# EasyEDA schematic SCH_Cansat_PCB_Flight_Computer_Only_2026-05-29.json
TITLE: CanSat Schematic; REV: 1.0; Date: 2026-03-24; Sheet: 1/1; Drawn By: Iker Garcia; Company: John Brown University
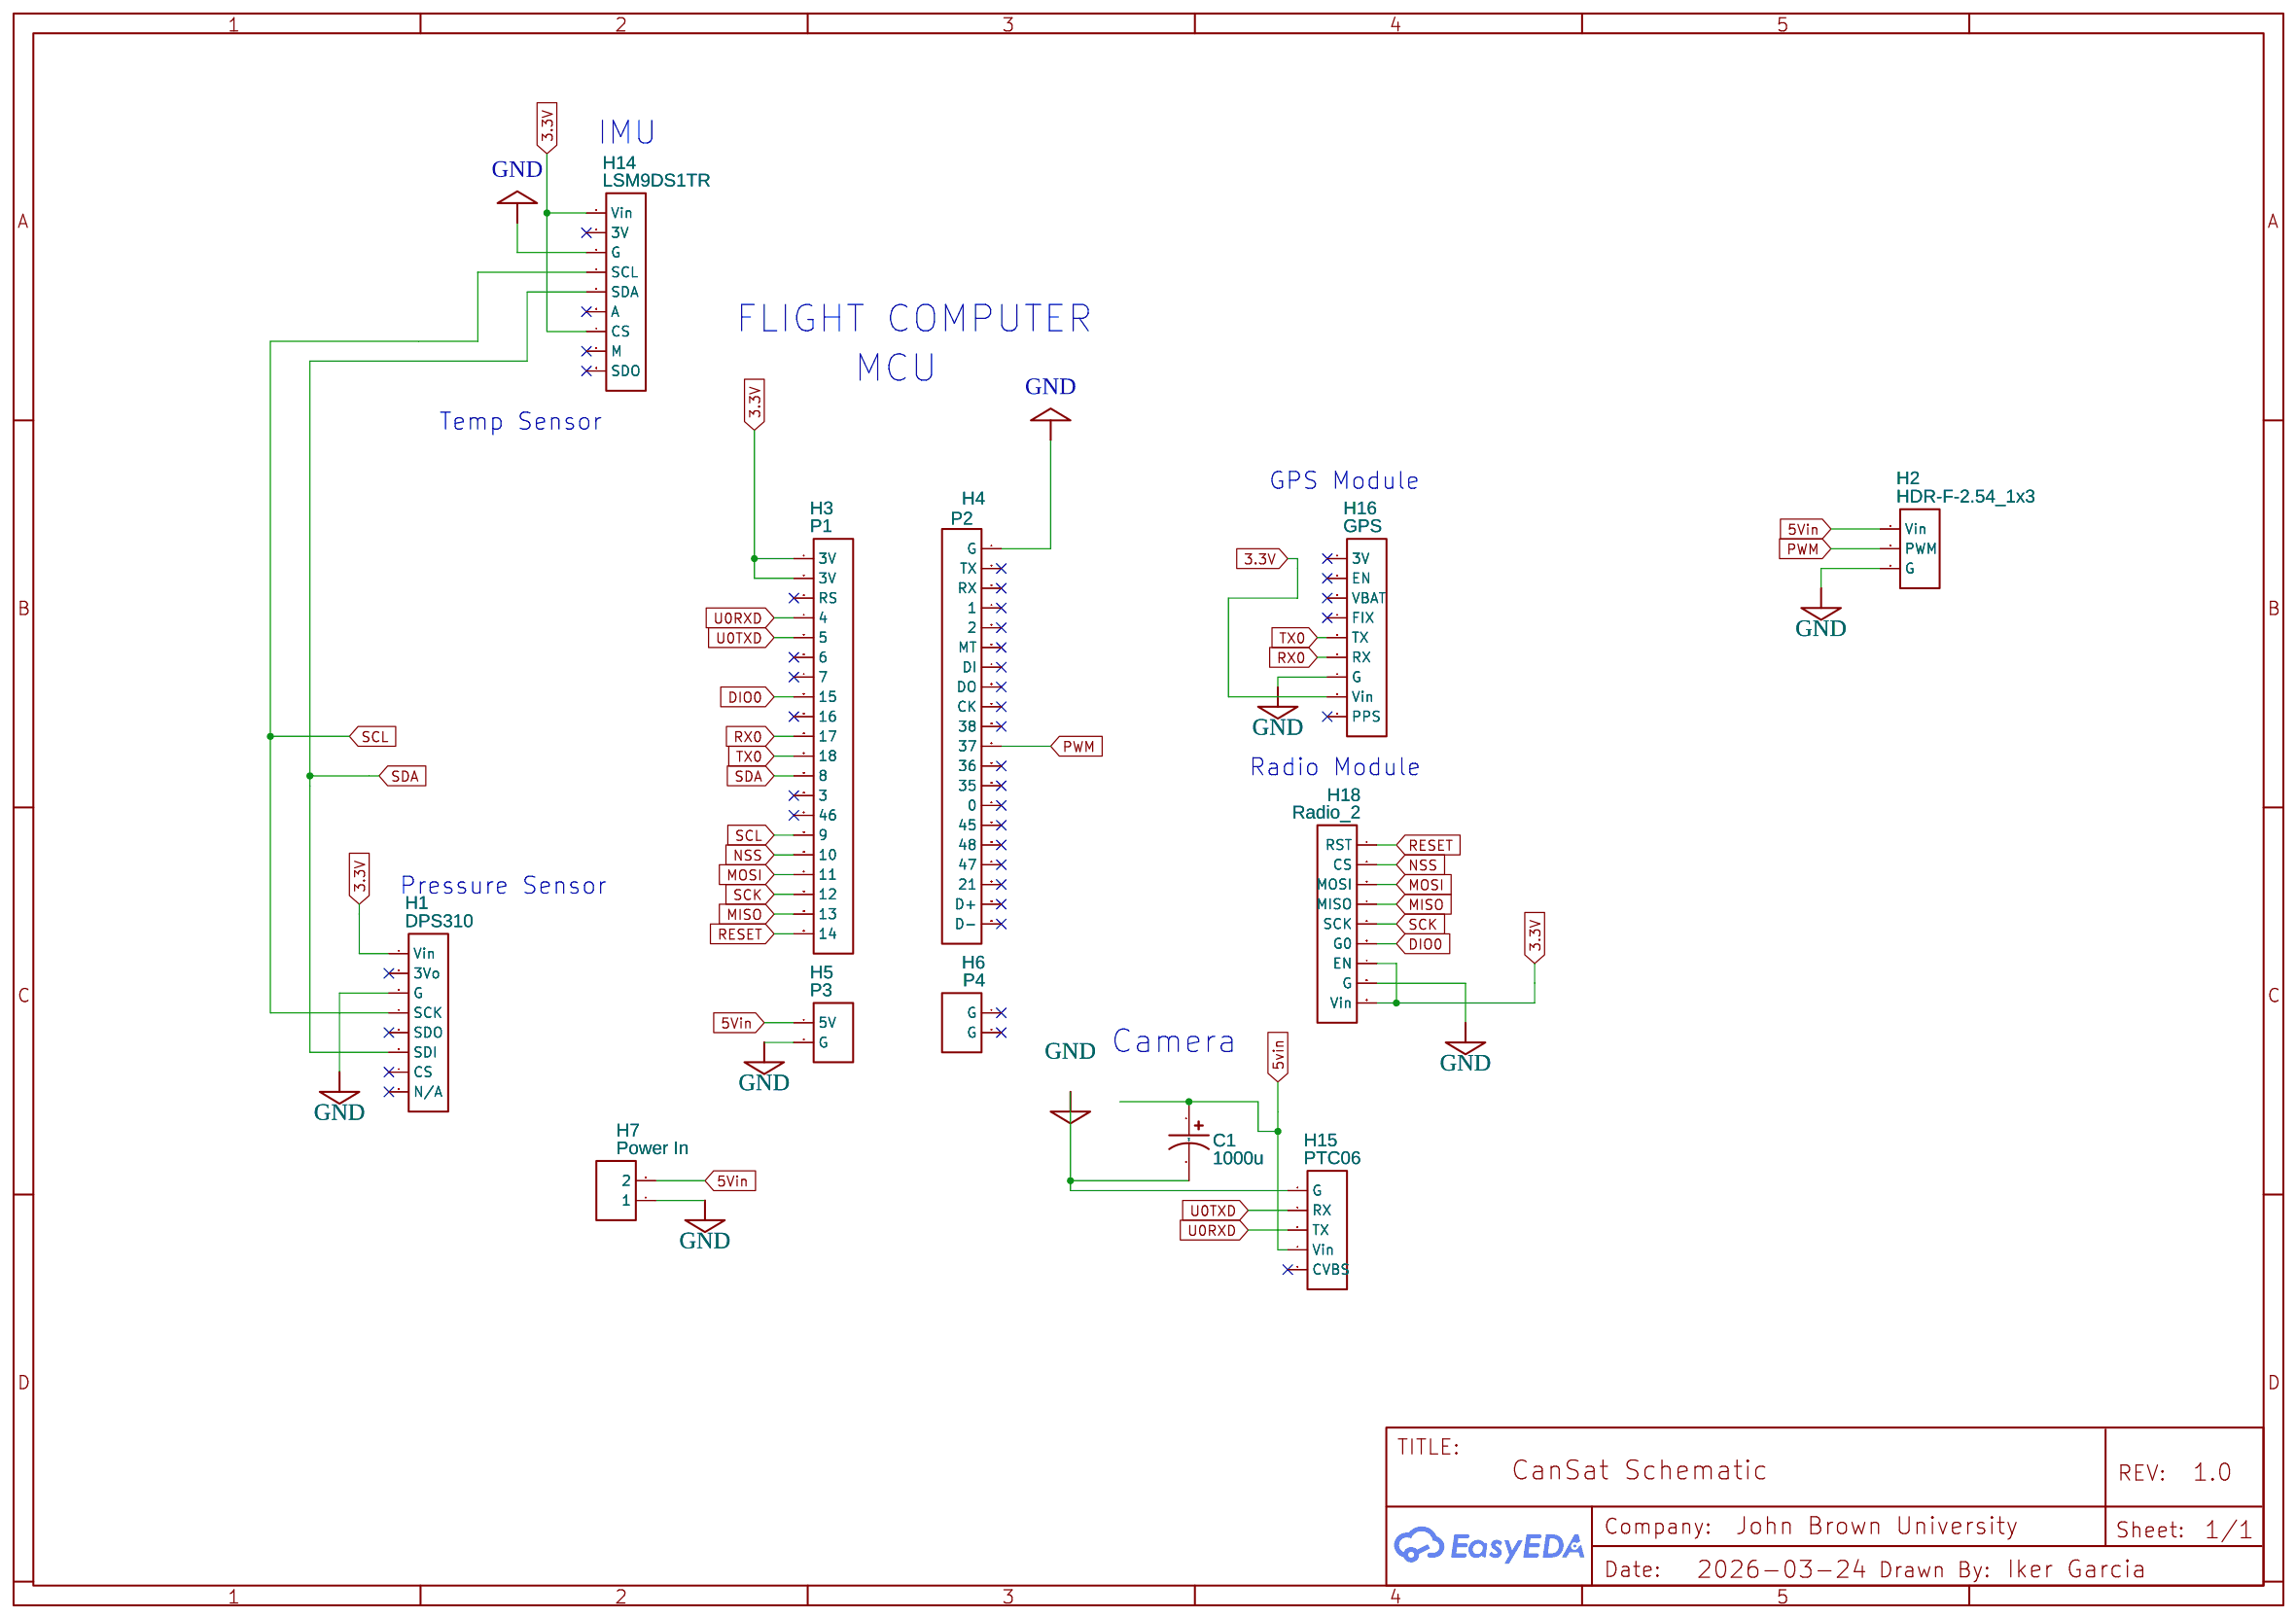
[diagram p0: schematic sheet]

## Parts
C1  1000u  [CAP-D6.3×F2.5]
H1  DPS310  [HDR-F-2.54_1X8]
H2  HDR-F-2.54_1x3  [HDR-F-2.54_1X3]
H3  P1  [HDR-F-2.54_1X20]
H4  P2  [HDR-F-2.54_1X20]
H5  P3  [HDR-F-2.54_1X2]
H6  P4  [HDR-F-2.54_1X2]
H7  Power In  [HDR-F-2.54_1X2]
H14  LSM9DS1TR  [HDR-F-2.54_1X9]
H15  PTC06  [HDR-F-2.54_1X5]
H16  GPS  [HDR-F-2.54_1X9]
H18  Radio_2  [HDR-F-2.54_1X9]

## Library data of the parts
C1 = CE_TH_D6.3×F2.5_US: Contributor: LCEDA_Lib
H1 = HDR-F-2.54_1x8: Supplier Part: C225505; Supplier: LCSC; Contributor: LCEDA_Lib
H2 = HDR-F-2.54_1x3: Supplier Part: C146690; Supplier: LCSC; Contributor: LCEDA_Lib
H3 H4 = HDR-F-2.54_1x20: Supplier Part: C50984; Supplier: LCSC; Contributor: LCEDA_Lib
H5-H7 = HDR-F-2.54_1x2: Supplier Part: C49661; Supplier: LCSC; Contributor: LCEDA_Lib
H14 H16 H18 = HDR-F-2.54_1x9: Supplier Part: C124417; Supplier: LCSC; Contributor: LCEDA_Lib
H15 = HDR-F-2.54_1x5: Supplier Part: C50950; Supplier: LCSC; Contributor: LCEDA_Lib

## Nets
3.3V: H1.1(Vin) H3.1(3V) H3.2(3V) H14.1(Vin) H14.7(CS) H16.8(Vin) H18.7(EN) H18.9(Vin)
5Vin: H2.1(Vin) H5.1(5V) H7.2
5vin: C1.1 H15.4(Vin)
GND: C1.2 H1.3(G) H2.3(G) H4.1(G) H5.2(G) H7.1 H14.3(G) H15.1(G) H16.7(G) H18.8(G)
DIO0: H3.8(15) H18.6(G0)
MISO: H3.19(13) H18.4(MISO)
MOSI: H3.17(11) H18.3(MOSI)
NSS: H3.16(10) H18.2(CS)
PWM: H2.2(PWM) H4.11(37)
RESET: H3.20(14) H18.1(RST)
RX0: H3.10(17) H16.6(RX)
SCK: H3.18(12) H18.5(SCK)
SCL: H1.4(SCK) H3.15(9) H14.4(SCL)
SDA: H1.6(SDI) H3.12(8) H14.5(SDA)
TX0: H3.11(18) H16.5(TX)
U0RXD: H3.4 H15.3(TX)
U0TXD: H3.5 H15.2(RX)

Not connected (* = marked no-connect by the designer): H1 2(3Vo)* 5(SDO)* 7(CS)* 8(N/A)*; H3 3(RS)* 6* 7* 9(16)* 13(3)* 14(46)*; H4 2(TX)* 3(RX)* 4(1)* 5(2)* 6(MT)* 7(DI)* 8(DO)* 9(CK)* 10(38)* 12(36)* 13(35)* 14(0)* 15(45)* 16(48)* 17(47)* 18(21)* 19(D+)* 20(D-)*; H6 1(G)* 2(G)*; H14 2(3V)* 6(A)* 8(M)* 9(SDO)*; H15 5(CVBS)*; H16 1(3V)* 2(EN)* 3(VBAT)* 4(FIX)* 9(PPS)*

## Notes on the sheet
- IMU
- FLIGHT COMPUTER
- MCU
- Temp Sensor
- GPS Module
- Radio Module
- Pressure Sensor
- Camera
